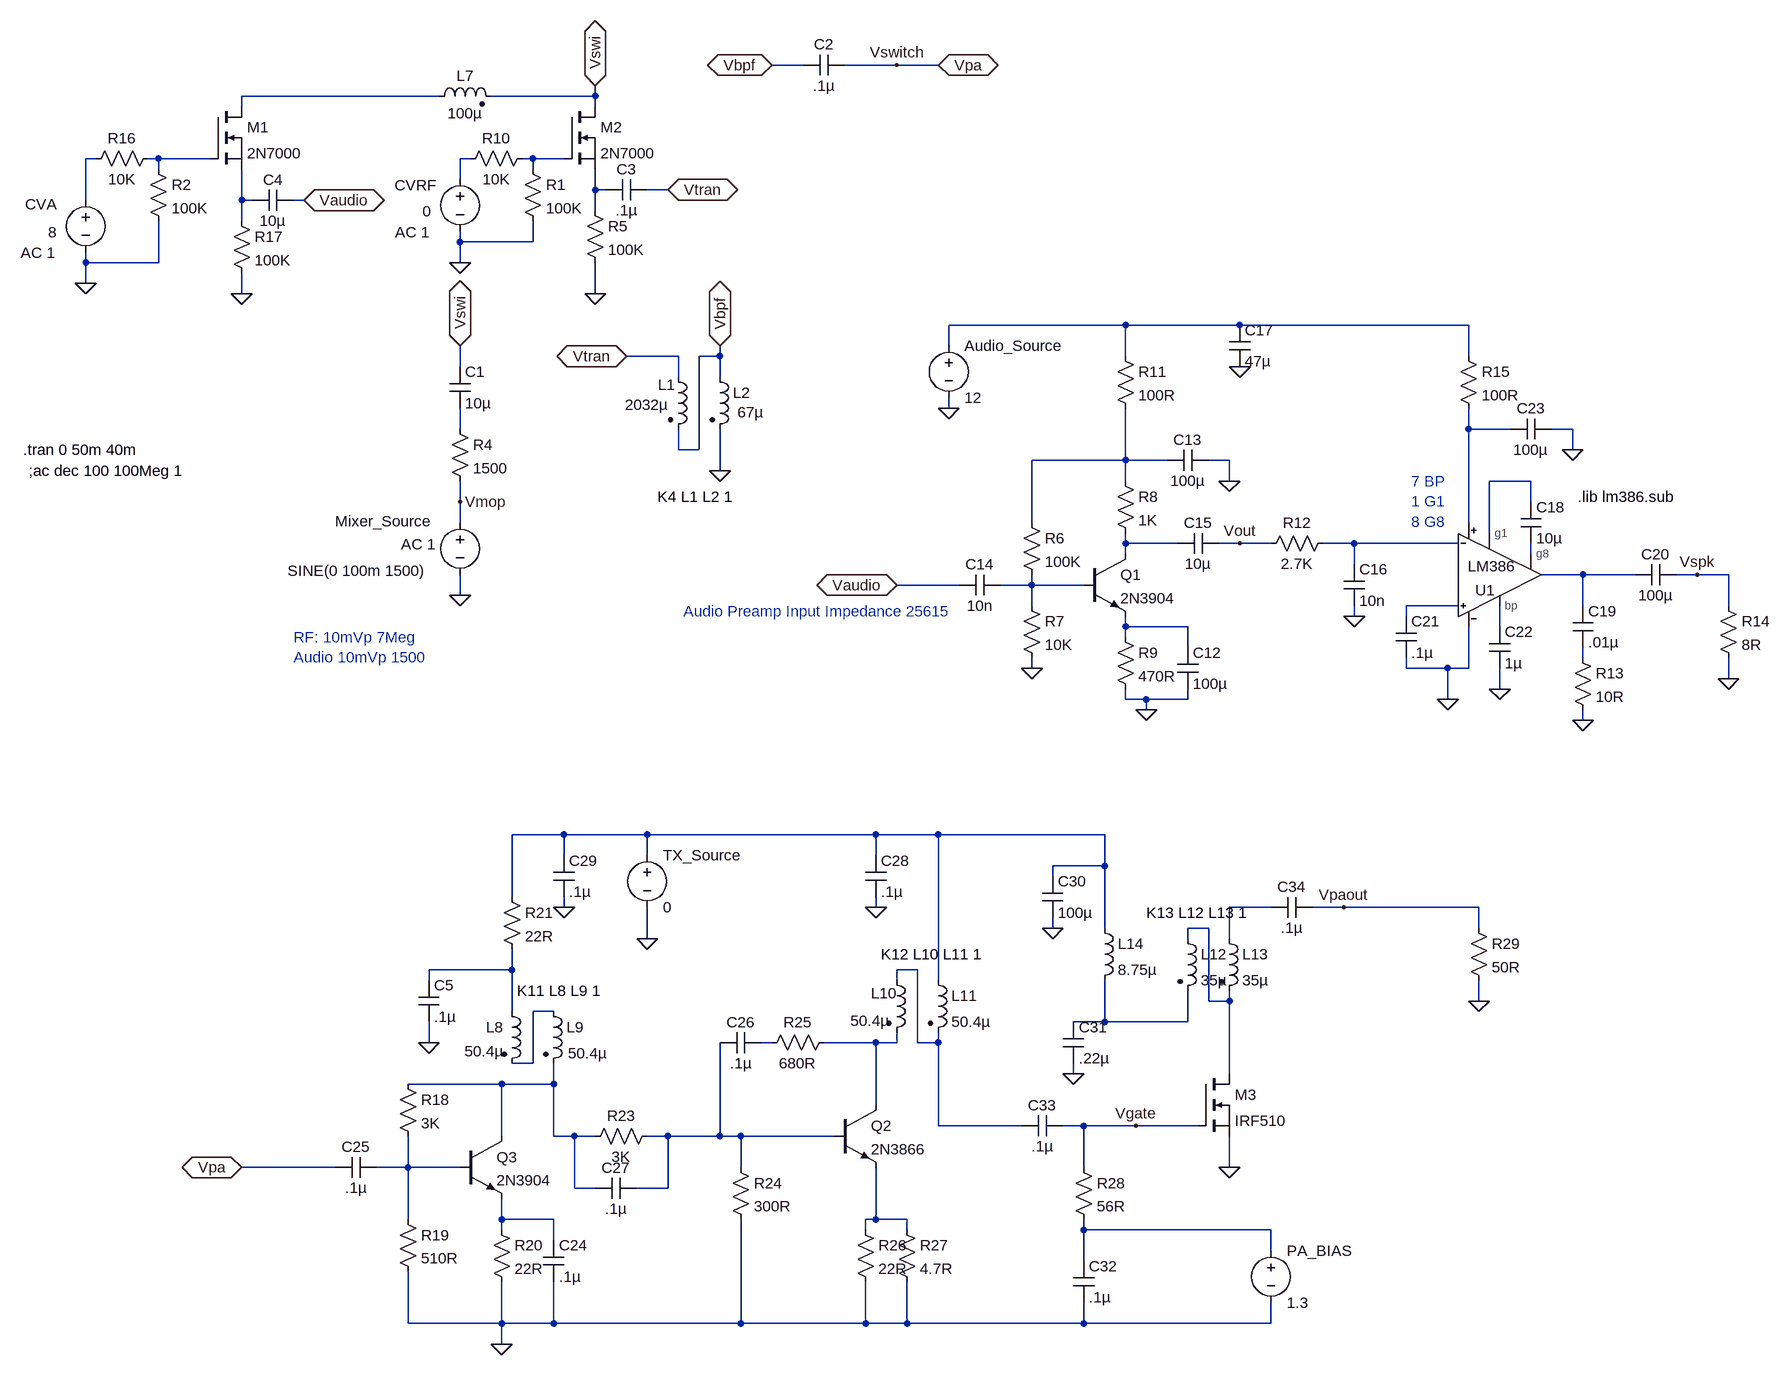
[diagram p0: schematic Transmit Chain 80m FET Switch Test.asc]
Transmit Chain 80m FET Switch Test.asc, the LTspice schematic file:
Version 4
SHEET 1 2548 2196
WIRE 224 208 176 208
WIRE 368 208 288 208
WIRE 432 208 368 208
WIRE -336 256 -640 256
WIRE -96 256 -96 240
WIRE -96 256 -256 256
WIRE -640 272 -640 256
WIRE -96 272 -96 256
WIRE -864 352 -880 352
WIRE -768 352 -784 352
WIRE -688 352 -768 352
WIRE -288 352 -304 352
WIRE -192 352 -208 352
WIRE -144 352 -192 352
WIRE -768 368 -768 352
WIRE -192 368 -192 352
WIRE -304 384 -304 352
WIRE -96 400 -96 368
WIRE -80 400 -96 400
WIRE 16 400 -16 400
WIRE -880 416 -880 352
WIRE -640 416 -640 368
WIRE -624 416 -640 416
WIRE -544 416 -560 416
WIRE -96 432 -96 400
WIRE -640 448 -640 416
WIRE -304 480 -304 464
WIRE -192 480 -192 448
WIRE -192 480 -304 480
WIRE -880 512 -880 496
WIRE -768 512 -768 448
WIRE -768 512 -880 512
WIRE -304 512 -304 480
WIRE -880 544 -880 512
WIRE -640 560 -640 528
WIRE -96 560 -96 512
WIRE 720 608 448 608
WIRE 896 608 720 608
WIRE 1248 608 896 608
WIRE 896 624 896 608
WIRE 448 640 448 608
WIRE 32 656 -48 656
WIRE 96 656 96 640
WIRE 96 656 64 656
WIRE 720 656 720 608
WIRE 1248 656 1248 608
WIRE -304 672 -304 640
WIRE 32 688 32 656
WIRE 96 688 96 656
WIRE 448 736 448 720
WIRE -304 768 -304 736
WIRE 1248 768 1248 736
WIRE 1312 768 1248 768
WIRE 1408 768 1376 768
WIRE 32 800 32 768
WIRE 64 800 64 656
WIRE 64 800 32 800
WIRE 1408 800 1408 768
WIRE 720 816 720 736
WIRE 720 816 576 816
WIRE 784 816 720 816
WIRE 880 816 848 816
WIRE 96 832 96 768
WIRE 720 848 720 816
WIRE 880 848 880 816
WIRE 1344 848 1280 848
WIRE -304 880 -304 848
WIRE 1344 880 1344 848
WIRE -304 912 -304 880
WIRE 576 912 576 816
WIRE 1248 912 1248 768
WIRE 1280 928 1280 848
WIRE 720 944 720 928
WIRE 800 944 720 944
WIRE 896 944 864 944
WIRE 944 944 896 944
WIRE 1072 944 1024 944
WIRE 1232 944 1072 944
WIRE 720 960 720 944
WIRE 1344 960 1344 944
WIRE 1072 976 1072 944
WIRE 1424 992 1360 992
WIRE 1504 992 1424 992
WIRE 1600 992 1568 992
WIRE 1648 992 1600 992
WIRE 464 1008 368 1008
WIRE 576 1008 576 992
WIRE 576 1008 528 1008
WIRE 656 1008 576 1008
WIRE -304 1024 -304 992
WIRE 576 1040 576 1008
WIRE 1232 1040 1152 1040
WIRE 1424 1040 1424 992
WIRE 1648 1040 1648 992
WIRE 1072 1056 1072 1040
WIRE 1152 1056 1152 1040
WIRE 720 1072 720 1056
WIRE 816 1072 720 1072
WIRE 1296 1072 1296 1040
WIRE 720 1088 720 1072
WIRE 816 1104 816 1072
WIRE 1424 1120 1424 1104
WIRE 576 1136 576 1120
WIRE 1152 1136 1152 1120
WIRE 1216 1136 1152 1136
WIRE 1248 1136 1248 1072
WIRE 1248 1136 1216 1136
WIRE 1648 1152 1648 1120
WIRE 1296 1168 1296 1136
WIRE 720 1184 720 1168
WIRE 752 1184 720 1184
WIRE 816 1184 816 1168
WIRE 816 1184 752 1184
WIRE 1216 1184 1216 1136
WIRE 752 1200 752 1184
WIRE 1424 1216 1424 1200
WIRE -144 1392 -224 1392
WIRE -16 1392 -144 1392
WIRE 336 1392 -16 1392
WIRE 432 1392 336 1392
WIRE 688 1392 432 1392
WIRE -144 1424 -144 1392
WIRE -16 1424 -16 1392
WIRE 336 1424 336 1392
WIRE 688 1440 688 1392
WIRE 688 1440 608 1440
WIRE 608 1456 608 1440
WIRE -224 1488 -224 1392
WIRE -144 1504 -144 1488
WIRE 336 1504 336 1488
WIRE 944 1504 880 1504
WIRE 1056 1504 1008 1504
WIRE 1264 1504 1056 1504
WIRE 608 1536 608 1520
WIRE 688 1536 688 1440
WIRE 848 1536 816 1536
WIRE 1264 1536 1264 1504
WIRE -16 1552 -16 1504
WIRE 816 1552 816 1536
WIRE 880 1552 880 1504
WIRE -224 1600 -224 1568
WIRE -224 1600 -352 1600
WIRE 400 1600 368 1600
WIRE -352 1616 -352 1600
WIRE 368 1616 368 1600
WIRE 432 1616 432 1392
WIRE 848 1648 848 1536
WIRE 880 1648 880 1632
WIRE 880 1648 848 1648
WIRE 1264 1648 1264 1616
WIRE -224 1664 -224 1600
WIRE -160 1664 -192 1664
WIRE 688 1680 688 1616
WIRE 688 1680 640 1680
WIRE 816 1680 816 1632
WIRE 816 1680 688 1680
WIRE -352 1712 -352 1680
WIRE 176 1712 160 1712
WIRE 336 1712 256 1712
WIRE 368 1712 368 1696
WIRE 368 1712 336 1712
WIRE 400 1712 400 1600
WIRE 432 1712 432 1696
WIRE 432 1712 400 1712
WIRE -192 1744 -192 1664
WIRE -192 1744 -224 1744
WIRE 640 1760 640 1744
WIRE 880 1760 880 1648
WIRE -240 1776 -384 1776
WIRE -160 1776 -160 1744
WIRE -160 1776 -240 1776
WIRE 336 1808 336 1712
WIRE 432 1840 432 1712
WIRE 560 1840 432 1840
WIRE 656 1840 624 1840
WIRE 736 1840 656 1840
WIRE 832 1840 736 1840
WIRE -240 1856 -240 1776
WIRE -160 1856 -160 1776
WIRE -128 1856 -160 1856
WIRE -96 1856 -128 1856
WIRE 16 1856 -16 1856
WIRE 96 1856 96 1712
WIRE 96 1856 16 1856
WIRE 128 1856 96 1856
WIRE 272 1856 128 1856
WIRE -496 1904 -640 1904
WIRE -384 1904 -384 1856
WIRE -384 1904 -432 1904
WIRE -304 1904 -384 1904
WIRE 128 1904 128 1856
WIRE 656 1904 656 1840
WIRE 880 1904 880 1856
WIRE -128 1936 -128 1856
WIRE -96 1936 -128 1936
WIRE 16 1936 16 1856
WIRE 16 1936 -32 1936
WIRE -384 1984 -384 1904
WIRE -240 1984 -240 1952
WIRE -160 1984 -240 1984
WIRE 336 1984 336 1904
WIRE 336 1984 320 1984
WIRE 384 1984 336 1984
WIRE -240 2000 -240 1984
WIRE 320 2000 320 1984
WIRE 384 2000 384 1984
WIRE 656 2000 656 1984
WIRE 944 2000 656 2000
WIRE -160 2016 -160 1984
WIRE 944 2032 944 2000
WIRE 656 2048 656 2000
WIRE -384 2144 -384 2064
WIRE -240 2144 -240 2080
WIRE -240 2144 -384 2144
WIRE -160 2144 -160 2080
WIRE -160 2144 -240 2144
WIRE 128 2144 128 1984
WIRE 128 2144 -160 2144
WIRE 320 2144 320 2080
WIRE 320 2144 128 2144
WIRE 384 2144 384 2080
WIRE 384 2144 320 2144
WIRE 656 2144 656 2112
WIRE 656 2144 384 2144
WIRE 944 2144 944 2112
WIRE 944 2144 656 2144
WIRE -240 2176 -240 2144
FLAG -880 544 0
FLAG 96 640 Vbpf
IOPIN 96 640 BiDir
FLAG 432 208 Vpa
IOPIN 432 208 BiDir
FLAG 448 736 0
FLAG 576 1136 0
FLAG 752 1200 0
FLAG 880 848 0
FLAG 896 944 Vout
FLAG 1072 1056 0
FLAG 896 672 0
FLAG 1216 1184 0
FLAG 1424 1216 0
FLAG 1648 1152 0
FLAG 1600 992 Vspk
FLAG 1296 1168 0
FLAG 1408 800 0
FLAG -304 1024 0
FLAG 368 208 Vswitch
FLAG 176 208 Vbpf
IOPIN 176 208 BiDir
FLAG 368 1008 Vaudio
IOPIN 368 1008 BiDir
FLAG -304 880 Vmop
FLAG 96 832 0
FLAG -544 416 Vaudio
IOPIN -544 416 BiDir
FLAG -304 640 Vswi
IOPIN -304 640 BiDir
FLAG -96 240 Vswi
IOPIN -96 240 BiDir
FLAG -48 656 Vtran
IOPIN -48 656 BiDir
FLAG 16 400 Vtran
IOPIN 16 400 BiDir
FLAG -304 512 0
FLAG -96 560 0
FLAG -640 560 0
FLAG -240 2176 0
FLAG -352 1712 0
FLAG -16 1552 0
FLAG 336 1504 0
FLAG -144 1504 0
FLAG 608 1536 0
FLAG 640 1760 0
FLAG 1264 1648 0
FLAG 880 1904 0
FLAG 1056 1504 Vpaout
FLAG 736 1840 Vgate
FLAG -640 1904 Vpa
IOPIN -640 1904 BiDir
SYMBOL voltage -880 400 R0
WINDOW 123 -100 97 Left 2
WINDOW 39 0 0 Left 2
WINDOW 0 -93 22 Left 2
WINDOW 3 -58 65 Left 2
SYMATTR Value2 AC 1
SYMATTR InstName CVA
SYMATTR Value 8
SYMBOL cap 288 192 R90
WINDOW 0 0 32 VBottom 2
WINDOW 3 32 32 VTop 2
SYMATTR InstName C2
SYMATTR Value .1µ
SYMBOL npn 656 960 R0
SYMATTR InstName Q1
SYMATTR Value 2N3904
SYMBOL res 560 896 R0
SYMATTR InstName R6
SYMATTR Value 100K
SYMBOL res 560 1024 R0
SYMATTR InstName R7
SYMATTR Value 10K
SYMBOL res 704 832 R0
SYMATTR InstName R8
SYMATTR Value 1K
SYMBOL res 704 1072 R0
SYMATTR InstName R9
SYMATTR Value 470R
SYMBOL cap 800 1104 R0
SYMATTR InstName C12
SYMATTR Value 100µ
SYMBOL cap 848 800 R90
WINDOW 0 0 32 VBottom 2
WINDOW 3 32 32 VTop 2
SYMATTR InstName C13
SYMATTR Value 100µ
SYMBOL cap 528 992 R90
WINDOW 0 0 32 VBottom 2
WINDOW 3 32 32 VTop 2
SYMATTR InstName C14
SYMATTR Value 10n
SYMBOL voltage 448 624 R0
WINDOW 123 0 0 Left 2
WINDOW 39 0 0 Left 2
SYMATTR InstName Audio_Source
SYMATTR Value 12
SYMBOL res 704 640 R0
SYMATTR InstName R11
SYMATTR Value 100R
SYMBOL cap 864 928 R90
WINDOW 0 0 32 VBottom 2
WINDOW 3 32 32 VTop 2
SYMATTR InstName C15
SYMATTR Value 10µ
SYMBOL LM386 1296 992 R0
WINDOW 3 -49 -13 Left 2
WINDOW 0 -38 24 Left 2
SYMATTR InstName U1
SYMBOL cap 1056 976 R0
SYMATTR InstName C16
SYMATTR Value 10n
SYMBOL cap 880 608 R0
SYMATTR InstName C17
SYMATTR Value 47µ
SYMBOL cap 1328 880 R0
SYMATTR InstName C18
SYMATTR Value 10µ
SYMBOL res 1040 928 R90
WINDOW 0 0 56 VBottom 2
WINDOW 3 32 56 VTop 2
SYMATTR InstName R12
SYMATTR Value 2.7K
SYMBOL cap 1408 1040 R0
SYMATTR InstName C19
SYMATTR Value .01µ
SYMBOL res 1408 1104 R0
SYMATTR InstName R13
SYMATTR Value 10R
SYMBOL cap 1568 976 R90
WINDOW 0 0 32 VBottom 2
WINDOW 3 32 32 VTop 2
SYMATTR InstName C20
SYMATTR Value 100µ
SYMBOL res 1632 1024 R0
SYMATTR InstName R14
SYMATTR Value 8R
SYMBOL cap 1136 1056 R0
SYMATTR InstName C21
SYMATTR Value .1µ
SYMBOL cap 1280 1072 R0
SYMATTR InstName C22
SYMATTR Value 1µ
SYMBOL cap 1376 752 R90
WINDOW 0 0 32 VBottom 2
WINDOW 3 32 32 VTop 2
SYMATTR InstName C23
SYMATTR Value 100µ
SYMBOL res 1232 640 R0
SYMATTR InstName R15
SYMATTR Value 100R
SYMBOL voltage -304 896 R0
WINDOW 3 -265 90 Left 2
WINDOW 123 -91 49 Left 2
WINDOW 39 0 0 Left 2
WINDOW 0 -192 14 Left 2
SYMATTR Value SINE(0 100m 1500)
SYMATTR Value2 AC 1
SYMATTR InstName Mixer_Source
SYMBOL res -320 752 R0
SYMATTR InstName R4
SYMATTR Value 1500
SYMBOL ind2 16 672 R0
WINDOW 0 -15 28 Left 2
WINDOW 3 -66 59 Left 2
SYMATTR InstName L1
SYMATTR Value 2032µ
SYMATTR Type ind
SYMBOL ind2 80 672 R0
WINDOW 3 43 70 Left 2
SYMATTR Value 67µ
SYMATTR InstName L2
SYMATTR Type ind
SYMBOL nmos -144 272 R0
SYMATTR InstName M2
SYMATTR Value 2N7000
SYMBOL res -208 352 R0
SYMATTR InstName R1
SYMATTR Value 100K
SYMBOL res -784 352 R0
SYMATTR InstName R2
SYMATTR Value 100K
SYMBOL voltage -304 368 R0
WINDOW 123 -100 97 Left 2
WINDOW 39 0 0 Left 2
WINDOW 0 -101 25 Left 2
WINDOW 3 -58 65 Left 2
SYMATTR Value2 AC 1
SYMATTR InstName CVRF
SYMATTR Value 0
SYMBOL res -192 336 R90
WINDOW 0 0 56 VBottom 2
WINDOW 3 32 56 VTop 2
SYMATTR InstName R10
SYMATTR Value 10K
SYMBOL res -768 336 R90
WINDOW 0 0 56 VBottom 2
WINDOW 3 32 56 VTop 2
SYMATTR InstName R16
SYMATTR Value 10K
SYMBOL cap -320 672 R0
SYMATTR InstName C1
SYMATTR Value 10µ
SYMBOL nmos -688 272 R0
SYMATTR InstName M1
SYMATTR Value 2N7000
SYMBOL res -112 416 R0
SYMATTR InstName R5
SYMATTR Value 100K
SYMBOL res -656 432 R0
SYMATTR InstName R17
SYMATTR Value 100K
SYMBOL cap -16 384 R90
WINDOW 0 0 32 VBottom 2
WINDOW 3 32 32 VTop 2
SYMATTR InstName C3
SYMATTR Value .1µ
SYMBOL cap -560 400 R90
WINDOW 0 0 32 VBottom 2
WINDOW 3 32 32 VTop 2
SYMATTR InstName C4
SYMATTR Value 10µ
SYMBOL ind2 -352 272 R270
WINDOW 0 32 56 VTop 2
WINDOW 3 5 56 VBottom 2
SYMATTR InstName L7
SYMATTR Value 100µ
SYMATTR Type ind
SYMBOL npn 272 1808 R0
SYMATTR InstName Q2
SYMATTR Value 2N3866
SYMBOL npn -304 1856 R0
SYMATTR InstName Q3
SYMATTR Value 2N3904
SYMBOL nmos 832 1760 R0
SYMATTR InstName M3
SYMATTR Value IRF510
SYMBOL res -400 1760 R0
SYMATTR InstName R18
SYMATTR Value 3K
SYMBOL res -400 1968 R0
SYMATTR InstName R19
SYMATTR Value 510R
SYMBOL res -256 1984 R0
SYMATTR InstName R20
SYMATTR Value 22R
SYMBOL res -240 1472 R0
SYMATTR InstName R21
SYMATTR Value 22R
SYMBOL ind2 -240 1648 R0
WINDOW 0 -24 40 Left 2
WINDOW 3 -57 77 Left 2
SYMATTR InstName L8
SYMATTR Value 50.4µ
SYMATTR Type ind
SYMBOL ind2 -176 1648 R0
WINDOW 3 38 80 Left 2
SYMATTR Value 50.4µ
SYMATTR InstName L9
SYMATTR Type ind
SYMBOL cap -368 1616 R0
SYMATTR InstName C5
SYMATTR Value .1µ
SYMBOL cap -176 2016 R0
SYMATTR InstName C24
SYMATTR Value .1µ
SYMBOL cap -432 1888 R90
WINDOW 0 0 32 VBottom 2
WINDOW 3 32 32 VTop 2
SYMATTR InstName C25
SYMATTR Value .1µ
SYMBOL voltage -16 1408 R0
WINDOW 123 0 0 Left 2
WINDOW 39 0 0 Left 2
SYMATTR InstName TX_Source
SYMATTR Value 0
SYMBOL res 0 1840 R90
WINDOW 0 0 56 VBottom 2
WINDOW 3 32 56 VTop 2
SYMATTR InstName R23
SYMATTR Value 3K
SYMBOL res 112 1888 R0
SYMATTR InstName R24
SYMATTR Value 300R
SYMBOL res 272 1696 R90
WINDOW 0 0 56 VBottom 2
WINDOW 3 32 56 VTop 2
SYMATTR InstName R25
SYMATTR Value 680R
SYMBOL cap 160 1696 R90
WINDOW 0 0 32 VBottom 2
WINDOW 3 32 32 VTop 2
SYMATTR InstName C26
SYMATTR Value .1µ
SYMBOL cap -96 1952 R270
WINDOW 0 32 32 VTop 2
WINDOW 3 0 32 VBottom 2
SYMATTR InstName C27
SYMATTR Value .1µ
SYMBOL ind2 352 1600 R0
WINDOW 0 -24 36 Left 2
WINDOW 3 -55 78 Left 2
SYMATTR InstName L10
SYMATTR Value 50.4µ
SYMATTR Type ind
SYMBOL ind2 416 1600 R0
SYMATTR InstName L11
SYMATTR Value 50.4µ
SYMATTR Type ind
SYMBOL res 304 1984 R0
SYMATTR InstName R26
SYMATTR Value 22R
SYMBOL res 368 1984 R0
SYMATTR InstName R27
SYMATTR Value 4.7R
SYMBOL cap 320 1424 R0
SYMATTR InstName C28
SYMATTR Value .1µ
SYMBOL cap -160 1424 R0
SYMATTR InstName C29
SYMATTR Value .1µ
SYMBOL ind2 800 1536 R0
SYMATTR InstName L12
SYMATTR Value 35µ
SYMATTR Type ind
SYMBOL ind2 864 1536 R0
SYMATTR InstName L13
SYMATTR Value 35µ
SYMATTR Type ind
SYMBOL ind 672 1520 R0
SYMATTR InstName L14
SYMATTR Value 8.75µ
SYMBOL cap 592 1456 R0
SYMATTR InstName C30
SYMATTR Value 100µ
SYMBOL cap 624 1680 R0
SYMATTR InstName C31
SYMATTR Value .22µ
SYMBOL res 640 1888 R0
SYMATTR InstName R28
SYMATTR Value 56R
SYMBOL cap 640 2048 R0
SYMATTR InstName C32
SYMATTR Value .1µ
SYMBOL voltage 944 2016 R0
WINDOW 123 0 0 Left 2
WINDOW 39 0 0 Left 2
SYMATTR InstName PA_BIAS
SYMATTR Value 1.3
SYMBOL cap 624 1824 R90
WINDOW 0 0 32 VBottom 2
WINDOW 3 32 32 VTop 2
SYMATTR InstName C33
SYMATTR Value .1µ
SYMBOL cap 1008 1488 R90
WINDOW 0 0 32 VBottom 2
WINDOW 3 32 32 VTop 2
SYMATTR InstName C34
SYMATTR Value .1µ
SYMBOL res 1248 1520 R0
SYMATTR InstName R29
SYMATTR Value 50R
TEXT 40 1048 Left 2 ;Audio Preamp Input Impedance 25615
TEXT -976 800 Left 2 !.tran 0 50m 40m
TEXT -968 832 Left 2 !;ac dec 100 100Meg 1
TEXT 1416 872 Left 2 !.lib lm386.sub
TEXT 1160 848 Left 2 ;7 BP\n1 G1\n8 G8
TEXT 0 872 Left 2 !K4 L1 L2 1
TEXT -216 1632 Left 2 !K11 L8 L9 1
TEXT 344 1576 Left 2 !K12 L10 L11 1
TEXT 752 1512 Left 2 !K13 L12 L13 1
TEXT -560 1088 Left 2 ;RF: 10mVp 7Meg\nAudio 10mVp 1500

The netlist it stands for:
* Transmit Chain 80m FET Switch Test.asc
V§CVA N002 0 8 AC 1
C2 Vswitch Vbpf .1µ
Q1 N013 N017 N019 0 2N3904
R6 N011 N017 100K
R7 N017 0 10K
R8 N011 N013 1K
R9 N019 0 470R
C12 N019 0 100µ
C13 0 N011 100µ
C14 N017 Vaudio 10n
V§Audio_Source N008 0 12
R11 N008 N011 100R
C15 Vout N013 10µ
XU1 N012 N014 N018 0 N016 N010 N020 N015 LM386 LM386  ; pins g1 In- In+ V- OUT V+ bp g8
C16 N014 0 10n
C17 N008 0 47µ
C18 N012 N015 10µ
R12 N014 Vout 2.7K
C19 N016 N021 .01µ
R13 N021 0 10R
C20 Vspk N016 100µ
R14 Vspk 0 8R
C21 N018 0 .1µ
C22 N020 0 1µ
C23 0 N010 100µ
R15 N008 N010 100R
V§Mixer_Source Vmop 0 SINE(0 100m 1500) AC 1
R4 N009 Vmop 1500
L1 Vtran Vbpf 2032µ
L2 Vbpf 0 67µ
M2 Vswi N005 N006 N006 2N7000
R1 N005 0 100K
R2 N003 0 100K
V§CVRF N004 0 0 AC 1
R10 N005 N004 10K
R16 N003 N002 10K
C1 Vswi N009 10µ
M1 N001 N003 N007 N007 2N7000
R5 N006 0 100K
R17 N007 0 100K
C3 Vtran N006 .1µ
C4 Vaudio N007 10µ
L7 N001 Vswi 100µ
Q2 N030 N032 N035 0 2N3866
Q3 N031 N033 N034 0 2N3904
M3 N024 Vgate 0 0 IRF510
R18 N031 N033 3K
R19 N033 0 510R
R20 N034 0 22R
R21 N022 N025 22R
L8 N025 N027 50.4µ
L9 N027 N031 50.4µ
C5 N025 0 .1µ
C24 N034 0 .1µ
C25 N033 Vswitch .1µ
V§TX_Source N022 0 0
R23 N032 N031 3K
R24 N032 0 300R
R25 N030 N029 680R
C26 N029 N032 .1µ
C27 N031 N032 .1µ
L10 N026 N030 50.4µ
L11 N022 N026 50.4µ
R26 N035 0 22R
R27 N035 0 4.7R
C28 N022 0 .1µ
C29 N022 0 .1µ
L12 N024 N028 35µ
L13 N023 N024 35µ
L14 N022 N028 8.75µ
C30 N022 0 100µ
C31 N028 0 .22µ
R28 Vgate N036 56R
C32 N036 0 .1µ
V§PA_BIAS N036 0 1.3
C33 Vgate N026 .1µ
C34 Vpaout N023 .1µ
R29 Vpaout 0 50R
.model NPN NPN
.model PNP PNP
.lib standard.bjt
.model NMOS NMOS
.model PMOS PMOS
.lib standard.mos
* Audio Preamp Input Impedance 25615
.tran 0 50m 40m
;ac dec 100 100Meg 1
.lib lm386.sub
* 7 BP
* 1 G1
* 8 G8
K4 L1 L2 1
K11 L8 L9 1
K12 L10 L11 1
K13 L12 L13 1
* RF: 10mVp 7Meg
* Audio 10mVp 1500
.lib LM386.sub
.backanno
.end